# EAGLE schematic Untitled (EAGLE 7.5.0)
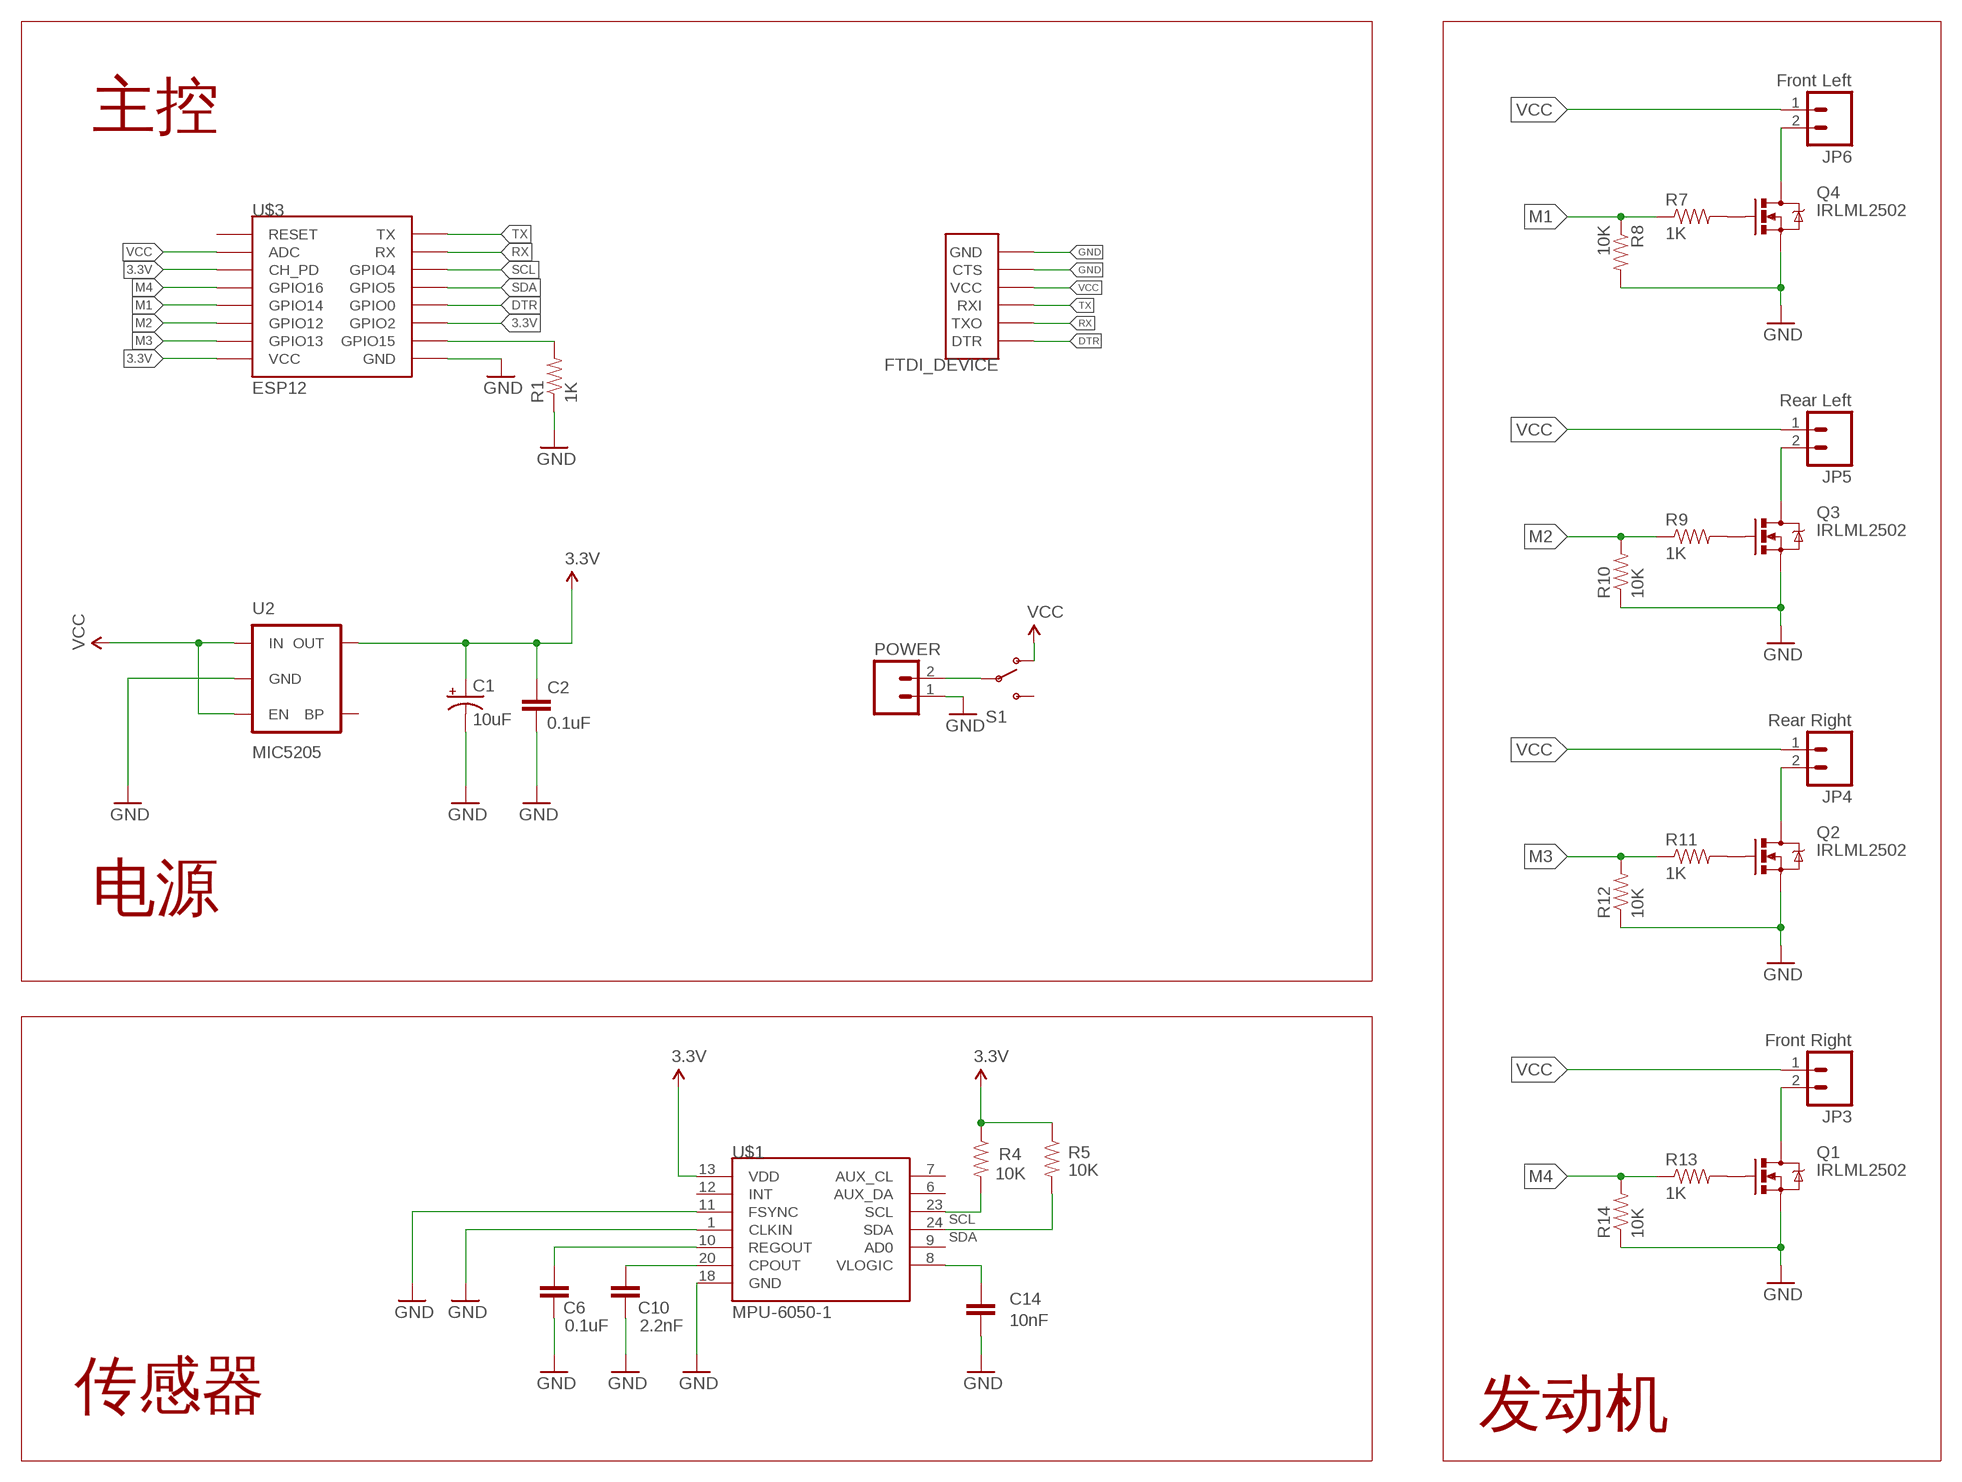
[diagram p0: schematic, sheet 1]

## Parts
C1  10uF  CAP_POL1206  [EIA3216]
C2  0.1uF  CAP0402-CAP  [0402-CAP]
C6  0.1uF  CAP0402-CAP  [0402-CAP]
C10  2.2nF  CAP0402-CAP  [0402-CAP]
C14  10nF  CAP0402-CAP  [0402-CAP]
FTDI  FTDI_DEVICE  [FTDI_DEVICE_SIDE]
JP3  Front Right  M02PTH3  [1X02_LONGPADS]
JP4  Rear Right  M02PTH3  [1X02_LONGPADS]
JP5  Rear Left  M02PTH3  [1X02_LONGPADS]
JP6  Front Left  M02PTH3  [1X02_LONGPADS]
POWER  M02PTH  [1X02]
Q1  IRLML2502  MOSFET-NCHANNELBSS138  [SOT23]
Q2  IRLML2502  MOSFET-NCHANNELBSS138  [SOT23]
Q3  IRLML2502  MOSFET-NCHANNELBSS138  [SOT23]
Q4  IRLML2502  MOSFET-NCHANNELBSS138  [SOT23]
R1  1K  RESISTOR0402-RES  [0402-RES]
R4  10K  RESISTOR0402-RES  [0402-RES]
R5  10K  RESISTOR0402-RES  [0402-RES]
R7  1K  RESISTOR0402-RES  [0402-RES]
R8  10K  RESISTOR0402-RES  [0402-RES]
R9  1K  RESISTOR0402-RES  [0402-RES]
R10  10K  RESISTOR0402-RES  [0402-RES]
R11  1K  RESISTOR0402-RES  [0402-RES]
R12  10K  RESISTOR0402-RES  [0402-RES]
R13  1K  RESISTOR0402-RES  [0402-RES]
R14  10K  RESISTOR0402-RES  [0402-RES]
S1  SWITCH-SPDTSMD2  [SWITCH-SPDT-SMD]
U2  MIC5205  MIC52055V  [SOT23-5]
U$1  MPU-6050-1  [QFN-24-4MM2]
U$3  ESP12  [ESP12]

## Nets
3.3V: C1.A(+) C2.1 R4.1 R5.1 U2.5(OUT) U$1.13(VDD) U$3.CH_PD U$3.GPIO2 U$3.VCC
DTR: FTDI.P$1(DTR) U$3.GPIO0
GND: C1.C(-) C2.2 C6.1 C10.1 C14.1 FTDI.P$5(CTS) FTDI.P$6(GND) POWER.1 Q1.2(S) Q2.2(S) Q3.2(S) Q4.2(S) R1.1 R8.2 R10.1 R12.1 R14.1 U2.2(GND) U$1.1(CLKIN) U$1.11(FSYNC) U$1.18(GND) U$3.GND
M1: R7.1 R8.1 U$3.GPIO14
M2: R9.1 R10.2 U$3.GPIO12
M3: R11.1 R12.2 U$3.GPIO13
M4: R13.1 R14.2 U$3.GPIO16
N$3: JP3.2 Q1.3(D)
N$5: C14.2 U$1.8(VLOGIC)
N$6: POWER.2 S1.2(P)
N$8: JP4.2 Q2.3(D)
N$12: JP5.2 Q3.3(D)
N$14: JP6.2 Q4.3(D)
N$20: R1.2 U$3.GPIO15
N$29: C6.2 U$1.10(REGOUT)
N$32: C10.2 U$1.20(CPOUT)
N$38: Q4.1(G) R7.2
N$39: Q3.1(G) R9.2
N$40: Q2.1(G) R11.2
N$41: Q1.1(G) R13.2
RX: FTDI.P$2(TXO) U$3.RX
SCL: R4.2 U$1.23(SCL) U$3.GPIO4
SDA: R5.2 U$1.24(SDA) U$3.GPIO5
TX: FTDI.P$3(RXI) U$3.TX
VCC: FTDI.P$4(VCC) JP3.1 JP4.1 JP5.1 JP6.1 S1.1(O) U2.1(IN) U2.3(EN) U$3.ADC
Unconnected: S1.3(S) U2.4(BP) U$1.6(AUX_DA) U$1.7(AUX_CL) U$1.9(AD0) U$1.12(INT) U$3.RESET

## Notes on the sheet
- 主控
- 电源
- 传感器 | 发动机

## Library data of the parts
C1 = SparkFun-Capacitors:CAP_POL: Capacitor Polarized These are standard SMD and PTH capacitors. Normally 10uF, 47uF, and 100uF in electrolytic and tantalum varieties. Always verify the external diameter of the through hole cap, it varies with capacity, voltage, and manufacturer. The EIA devices should be standard.
C2 C6 C10 C14 = SparkFun-Capacitors:CAP: Capacitor Standard 0603 ceramic capacitor, and 0.1" leaded capacitor.
FTDI = SparkFun-Connectors:FTDI_DEVICE: Connector which mates to FTDI basic or FTDI cable.
JP3-JP6 POWER = SparkFun-Connectors:M02: Standard 2-pin 0.1" header. Use with - straight break away headers ( PRT-00116) - right angle break away headers (PRT-00553) - swiss pins (PRT-00743) - machine pins (PRT-00117) - female headers (PRT-00115) Molex polarized connector foot print use with: PRT-08233 with associated crimp pins and housings. 2.54_SCREWTERM for use with PRT-10571. 3.5mm Screw Terminal footprints for PRT-08084 5mm Screw Terminal footprints for use with PRT-08433
Q1-Q4 = SparkFun-DiscreteSemi:MOSFET-NCHANNEL: Common NMOSFET Parts MFG P/N Store ID Prod ID FDD8780 TRANS-09984 SI7820DN TRANS-11055 FDS6630A IC-08089 2N7002PW TRANS-11151 FQP30N06L COM-10213 TRANS-10060 BSS123LT1G TRANS-08345 BSS138 TRANS-00830 BS170 2N7000; PROD_ID: TRANS-00830
R1 R4 R5 R7-R14 = SparkFun-Passives:RESISTOR: Resistor Basic schematic elements and footprints for 0603, 1206, and PTH resistors.
S1 = SparkFun-Electromechanical:SWITCH-SPDT: SPDT Switch Simple slide switch, Spark Fun Electronics SKU : COM-00102 DPDT SMT slide switch, AYZ0202, SWCH-08179
U2 = SparkFun-PowerIC:MIC5205: MIC5205 150mA vreg 3.3V - VREG-00822 5V - VREG-00823; PROD_ID: VREG-00823
U$1 = Testing:MPU-6050
U$3 = esp8266modules:ESP12: ESP8266 Wifi module 12